# EasyEDA Pro project ProPrj_NRF9151 GILBERTO8_2026-06-28.epro, schematic Schematic1
Board Name: Board2; Create Date: 2026-05-17; Page Name: P1; Project Name: NRF9151 GILBERTO8; Schematic Name: Schematic1; Update Date: 2026-05-17; Company: EasyEDA.com; Page Size: A4; Version: V1.0
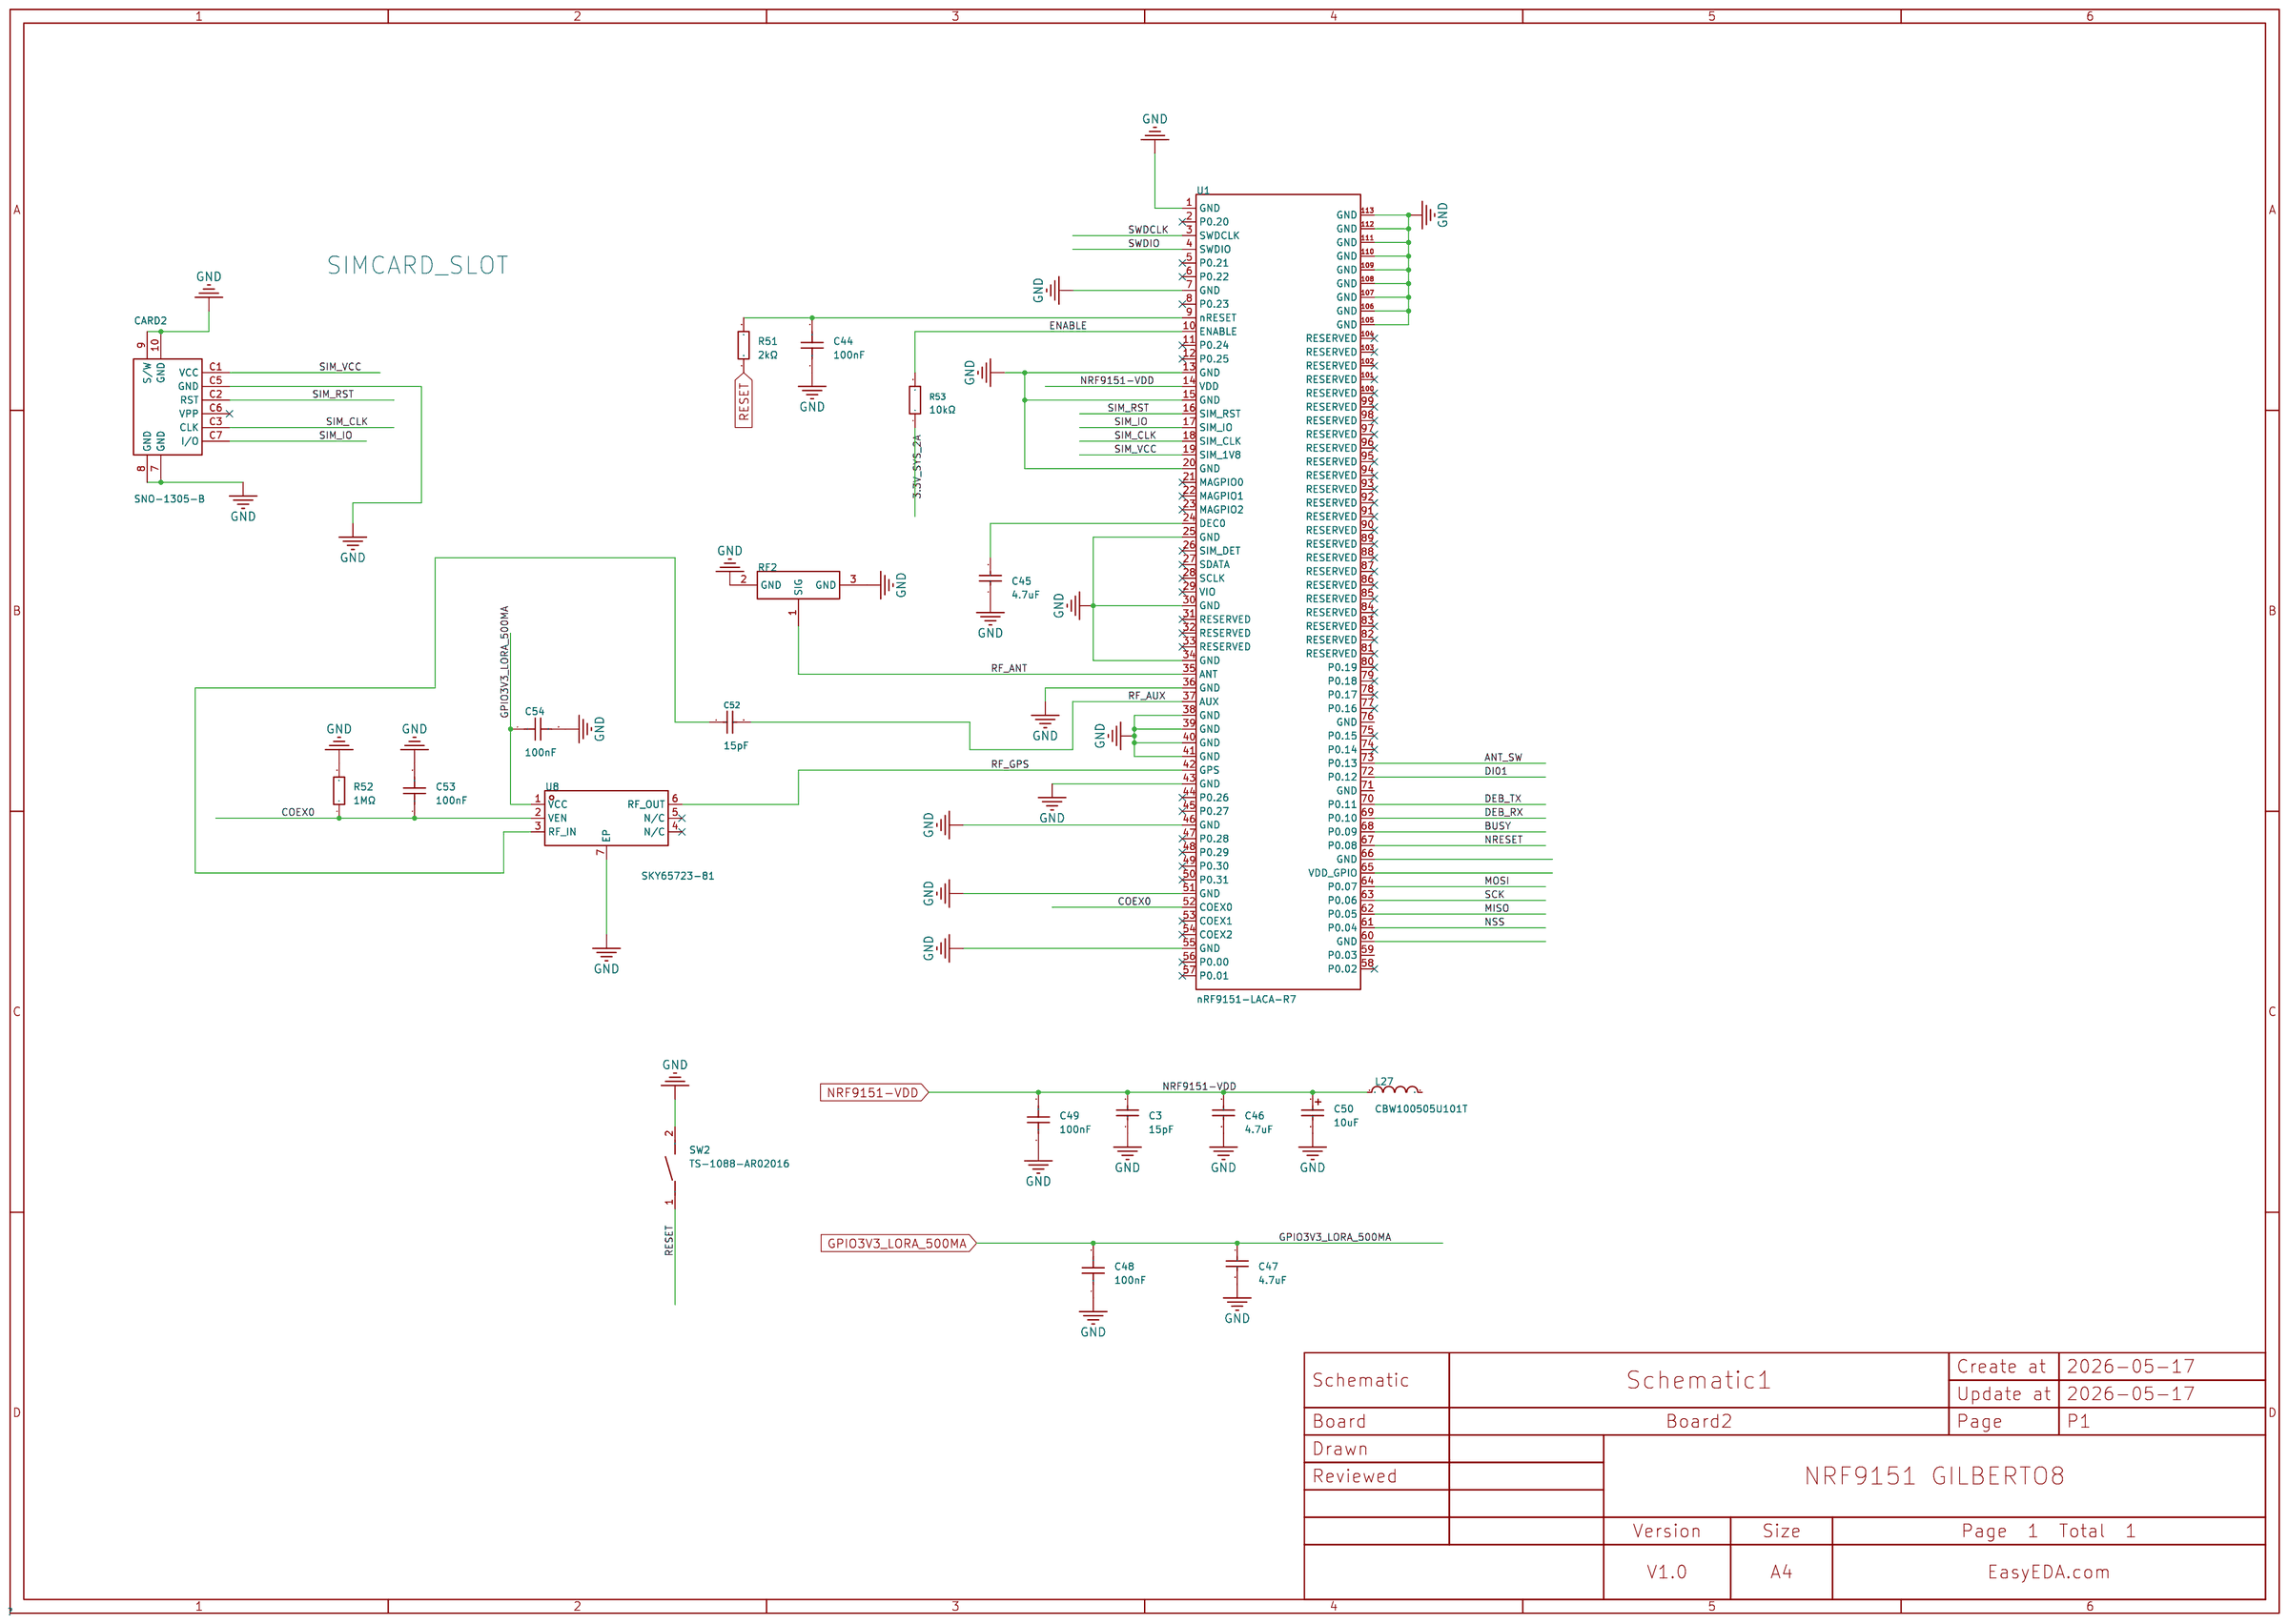
[diagram p1: schematic sheet]

## Parts
C3  15pF  [C0402]
C44  100nF  [C0402]
C45  4.7uF  [C0402]
C46  4.7uF  [C0402]
C47  4.7uF  [C0402]
C48  100nF  [C0402]
C49  100nF  [C0402]
C50  10uF  [CASE-A_3216]
C52  15pF  [C0201]
C53  100nF  [C0201]
C54  100nF  [C0201]
CARD2  SNO-1305-B  [SIM-SMD_SIM-1305-6P]
L27  CBW100505U101T  [L0402]
R51  2kΩ  [R0402]
R52  1MΩ  [R0402]
R53  10kΩ  [R0402]
RF2  6GHz  [RF-SMD_FRF05002-JSS103M]
SW2  TS-1088-AR02016  [SW-SMD_L3.9-W3.0-P4.45]
U1  nRF9151-LACA-R7  [LGA-113_L12.1-W11.1_NRF9151-LACA-R7]
U8  SKY65723-81  [MCM-6_L2.3-W1.7-P0.54-TL-EP]

## Library data of the parts
C3 = 0402CG150J500NT: Capacitance:15pF Tolerance:±5% Tolerance:±5% Voltage Rating:50V Temperature Coefficient:C0G; LCSC Part Name: 15pF ±5% 50V; Supplier Part: C1548; Manufacturer: FH(风华); Supplier Footprint: 0402; Datasheet: https://item.szlcsc.com/datasheet/0402CG150J500NT/1900.html; Supplier: LCSC; Tolerance: ±5%; Voltage Rating: 50V; Temperature Coefficient: C0G
C44 C48 C49 = CL05B104KO5NNNC: Capacitance:100nF Tolerance:±10% Tolerance:±10% Voltage Rating:16V Temperature Coefficient:X7R; LCSC Part Name: 100nF ±10% 16V; Supplier Part: C1525; Manufacturer: SAMSUNG(三星); Supplier Footprint: 0402; JLCPCB Part Class: Basic Part; Datasheet: https://item.szlcsc.com/datasheet/CL05B104KO5NNNC/1877.html; Supplier: LCSC; Tolerance: ±10%; Voltage Rating: 16V; Temperature Coefficient: X7R
C45-C47 = C1005X5R0J475MTJ00E: Capacitance:4.7uF Tolerance:±20% Tolerance:±20% Voltage Rating:6.3V Temperature Coefficient:X5R; LCSC Part Name: 4.7uF ±20% 6.3V; Supplier Part: C23687; Manufacturer: TDK; Supplier Footprint: 0402; Datasheet: https://item.szlcsc.com/datasheet/C1005X5R0J475MTJ00E/24423.html; Supplier: LCSC; Tolerance: ±20%; Voltage Rating: 6.3V; Temperature Coefficient: X5R
C50 = TAJA106K010RNJ: Capacitance:10uF Tolerance:±10% Tolerance:±10% Voltage Rating:10V Equivalent Series Resistance(ESR):3Ω@100kHz Operating Temperature:-55℃~+125℃ Operating Temperature:-55℃~+125℃; LCSC Part Name: 10uF ±10% 10V; Supplier Part: C7177; Manufacturer: Kyocera AVX; Supplier Footprint: CASE-A-3216-18(mm); Supplier: LCSC; Tolerance: ±10%; Voltage Rating: 10V; Equivalent Series Resistance(ESR): 3Ω@100kHz; Operating Temperature: -55℃~+125℃
C52 = 0201CG150J500NT: Capacitance:15pF Tolerance:±5% Tolerance:±5% Voltage Rating:50V Temperature Coefficient:C0G; LCSC Part Name: 15pF ±5% 50V; Supplier Part: C64554; Manufacturer: FH(风华); Supplier Footprint: 0201; Datasheet: https://item.szlcsc.com/datasheet/0201CG150J500NT/65621.html; Supplier: LCSC; Tolerance: ±5%; Voltage Rating: 50V; Temperature Coefficient: C0G
C53 C54 = CL03A104KP3NNNC: Capacitance:100nF Tolerance:±10% Tolerance:±10% Voltage Rating:10V Temperature Coefficient:X5R; LCSC Part Name: 100nF ±10% 10V; Supplier Part: C49062; Manufacturer: SAMSUNG(三星); Supplier Footprint: 0201; JLCPCB Part Class: Extended Part; Datasheet: https://item.szlcsc.com/datasheet/CL03A104KP3NNNC/50070.html; Supplier: LCSC; Tolerance: ±10%; Voltage Rating: 10V; Temperature Coefficient: X5R
CARD2 = SNO-1305-B: Card Connection Mode:Hinged Lid Card Type:Nano-SIM Card Connector Type:Connector and Ejector Card Detection:No Card Detect Height Above Board:1.4mm Operating Temperature:-35℃~+75℃ Operating Temperature:-35℃~+75℃; LCSC Part Name: 翻盖式 NanoSIM卡 卡座; Supplier Part: C111371; Manufacturer: SOFNG(硕方); Supplier Footprint: SMD; JLCPCB Part Class: Extended Part; Datasheet: https://item.szlcsc.com/datasheet/SNO-1305-B/112597.html; Supplier: LCSC; Card Connection Mode: Hinged Lid; Card Type: Nano-SIM Card; Connector Type: Connector and Ejector; Card Detection: No Card Detect; Height Above Board: 1.4mm; Operating Temperature: -35℃~+75℃
L27 = CBW100505U101T: Impedance @ Frequency:100Ω@100MHz Tolerance:±25% Tolerance:±25% DC Resistance(DCR):200mΩ Current Rating:450mA Number of Circuits:1; LCSC Part Name: 单路 0402磁珠 阻抗100Ω@100MHz; Supplier Part: C124089; Manufacturer: FH(风华); Supplier Footprint: 0402; Datasheet: https://item.szlcsc.com/datasheet/CBW100505U101T/125363.html; Supplier: LCSC; Impedance @ Frequency: 100Ω@100MHz; Tolerance: ±25%; DC Resistance(DCR): 200mΩ; Current Rating: 450mA; Number of Circuits: 1
R51 = RC0402FR-072KL: Type:Thick Film Resistor Resistance:2kΩ Tolerance:±1% Tolerance:±1% Power(Watts):62.5mW Voltage-Supply(Max):50V Temperature Coefficient:±100ppm/℃ Temperature Coefficient:±100ppm/℃ Operating Temperature:-55℃~+155℃ Operating Temperature:-55℃~+155℃; LCSC Part Name: 厚膜电阻 2kΩ ±1% 62.5mW; Supplier Part: C60488; Manufacturer: YAGEO(国巨); Supplier Footprint: 0402; JLCPCB Part Class: Extended Part; Datasheet: https://item.szlcsc.com/datasheet/RC0402FR-072KL/61540.html; Supplier: LCSC; Type: Thick Film Resistor; Tolerance: ±1%; Power(Watts): 62.5mW; Voltage-Supply(Max): 50V; Temperature Coefficient: ±100ppm/℃; Operating Temperature: -55℃~+155℃
R52 = CR0402FF1004G: Type:Thick Film Resistors Resistance: Tolerance:±1% Tolerance:±1% Power(Watts): Overload Voltage (Max): Temperature Coefficient:±200ppm/℃ Temperature Coefficient:±200ppm/℃ Operating Temperature Range:-55℃~+125℃ Operating Temperature Range:-55℃~+125℃; LCSC Part Name: 厚膜电阻 1MΩ ±1% 62.5mW; Supplier Part: C100198; Manufacturer: LIZ(丽智电子); Supplier Footprint: 0402; JLCPCB Part Class: Extended Part; Datasheet: https://atta.szlcsc.com/upload/public/pdf/source/20180403/C189438_6D658388CC7843F35BBC9018D03F0B8E.pdf; Supplier: LCSC; Type: Thick Film Resistors; Tolerance: ±1%; Temperature Coefficient: ±200ppm/℃; Operating Temperature Range: -55℃~+125℃
R53 = 0402WGJ0103TCE: Type:Thick Film Resistor Resistance:10kΩ Tolerance:±5% Tolerance:±5% Power(Watts):62.5mW Voltage-Supply(Max):50V Temperature Coefficient:±100ppm/℃ Temperature Coefficient:±100ppm/℃ Operating Temperature:-55℃~+155℃ Operating Temperature:-55℃~+155℃; LCSC Part Name: 10kΩ ±5% 62.5mW 厚膜电阻; Supplier Part: C25531; Manufacturer: UNI-ROYAL(厚声); Supplier Footprint: 0402; Datasheet: https://item.szlcsc.com/datasheet/0402WGJ0103TCE/26274.html; Supplier: LCSC; Type: Thick Film Resistor; Tolerance: ±5%; Power(Watts): 62.5mW; Voltage-Supply(Max): 50V; Temperature Coefficient: ±100ppm/℃; Operating Temperature: -55℃~+155℃
RF2 = U.FL-R-SMT-1(80)_C88374: Connector Type:Board Side Interface:Male Pin Number of Ports:1 Interface Diameter:2mm Interface Length/Height:1.25mm Frequency:6GHz RF Series:IPEX Impedance:50Ω Style:- Operating Temperature Range:-40℃~+90℃ Operating Temperature Range:-40℃~+90℃; LCSC Part Name: IPEX 内针; Supplier Part: C88374; Manufacturer: HRS(广濑); Manufacturer Part: U.FL-R-SMT-1(80); Supplier Footprint: SMD; JLCPCB Part Class: Extended Part; Datasheet: https://item.szlcsc.com/datasheet/U.FL-R-SMT-1(80)/89553.html; Supplier: LCSC; Connector Type: Board Side; Interface: Male Pin; Number of Ports: 1; Interface Diameter: 2mm; Interface Length/Height: 1.25mm; RF Series: IPEX; Impedance: 50Ω; Operating Temperature Range: -40℃~+90℃
SW2 = TS-1088-AR02016: Circuit:SPST Actuator Style:Round Button Operating Force:1.6N Mounting Type:Surface Mount,Vertical Length:4mm Width:3mm Switch Height:2mm with Bracket:Without Bracket Contact Current:50mA Voltage Rating:12V Actuator/Cap Color:Black Termination Style:SMD(S; LCSC Part Name: 4*3*2mm 立贴 轻触开关; Supplier Part: C720477; Manufacturer: XUNPU(讯普); Supplier Footprint: SMD,4x3mm; JLCPCB Part Class: Basic Part; Datasheet: https://item.szlcsc.com/datasheet/TS-1088-AR02016/763484.html; Supplier: LCSC; Circuit: SPST; Actuator Style: Round Button; Operating Force: 1.6N; Mounting Type: Surface Mount,Vertical; Length: 4mm; Width: 3mm; Switch Height: 2mm; with Bracket: Without Bracket; Contact Current: 50mA; Voltage Rating: 12V; Actuator/Cap Color: Black; Termination Style: SMD(SMT) Tab; Life: 100,000 Cycles; Operating Temperature: -30℃~+80℃
U1 = NRF9151-LACA-R_C42236596: LGA-113(12.1x11.1) RF Modules ROHS; LCSC Part Name: NRF9151-LACA-R; Supplier Part: C22397843; Manufacturer: Nordic Semicon; Supplier Footprint: LGA-113(12.1x11.1); JLCPCB Part Class: Extended Part; Datasheet: https://atta.szlcsc.com/upload/public/pdf/source/20250220/C59DB80833A870E26845E8E79822579D.pdf; Supplier: JLCPCB
U8 = SKY65723-81: Frequency Range:1.559GHz~1.606GHz Frequency Range:1.559GHz~1.606GHz Gain:16.8dB Noise Figure:1.6dB Voltage - Supply:1.62V~3.6V Voltage - Supply:1.62V~3.6V Current - Supply:4.2mA; Supplier Part: C2654196; Manufacturer: SKYWORKS; Supplier Footprint: MCM-6(1.7x2.3); Datasheet: https://item.szlcsc.com/datasheet/SKY65723-81/2746105.html; Supplier: LCSC; Frequency Range: 1.559GHz~1.606GHz; Gain: 16.8dB; Noise Figure: 1.6dB; Voltage - Supply: 1.62V~3.6V; Current - Supply: 4.2mA

## Nets
3.3V_SYS_2A: R53.1
GND: C3.1 C44.1 C45.1 C46.2 C47.2 C48.1 C49.1 C50.2 C53.2 C54.2 CARD2.7(GND) CARD2.8(GND) CARD2.9(S/W) CARD2.10(GND) CARD2.C5(GND) R52.2 RF2.2(GND) RF2.3(GND) SW2.2 U1.1(GND) U1.7(GND) U1.13(GND) U1.15(GND) U1.20(GND) U1.25(GND) U1.30(GND) U1.34(GND) U1.36(GND) U1.38(GND) U1.39(GND) U1.40(GND) U1.41(GND) U1.43(GND) U1.46(GND) U1.51(GND) U1.55(GND) U1.105(GND) U1.106(GND) U1.107(GND) U1.108(GND) U1.109(GND) U1.110(GND) U1.111(GND) U1.112(GND) U1.113(GND) U8.7(EP)
ANT_SW: U1.73(P0.13)
BUSY: U1.68(P0.09)
COEX0: C53.1 R52.1 U1.52(COEX0) U8.2(VEN)
DEB_RX: U1.69(P0.10)
DEB_TX: U1.70(P0.11)
DI01: U1.72(P0.12)
ENABLE: R53.2 U1.10(ENABLE)
GPIO3V3_LORA_500MA: C47.1 C48.2 C54.1 U8.1(VCC)
MISO: U1.62(P0.05)
MOSI: U1.64(P0.07)
NRESET: U1.67(P0.08)
NRF9151-VDD: C3.2 C46.1 C49.2 C50.1 L27.1 U1.14(VDD)
NSS: U1.61(P0.04)
RESET: R51.1 SW2.1
RF_ANT: RF2.1(SIG) U1.35(ANT)
RF_AUX: C52.2 U1.37(AUX)
RF_GPS: U1.42(GPS) U8.6(RF_OUT)
SCK: U1.63(P0.06)
SIM_CLK: CARD2.C3(CLK) U1.18(SIM_CLK)
SIM_IO: CARD2.C7(I/O) U1.17(SIM_IO)
SIM_RST: CARD2.C2(RST) U1.16(SIM_RST)
SIM_VCC: CARD2.C1(VCC) U1.19(SIM_1V8)
SWDCLK: U1.3(SWDCLK)
SWDIO: U1.4(SWDIO)
Net-(C44-2): C44.2 R51.2 U1.9(nRESET)
Net-(C45-2): C45.2 U1.24(DEC0)
Net-(C52-1): C52.1 U8.3(RF_IN)

Not connected (* = marked no-connect by the designer): CARD2 C6(VPP)*; L27 2; U1 2(P0.20)* 5(P0.21)* 6(P0.22)* 8(P0.23)* 11(P0.24)* 12(P0.25)* 21(MAGPIO0)* 22(MAGPIO1)* 23(MAGPIO2)* 26(SIM_DET)* 27(SDATA)* 28(SCLK)* 29(VIO)* 31(RESERVED)* 32(RESERVED)* 33(RESERVED)* 44(P0.26)* 45(P0.27)* 47(P0.28)* 48(P0.29)* 49(P0.30)* 50(P0.31)* 53(COEX1)* 54(COEX2)* 56(P0.00)* 57(P0.01)* 58(P0.02)* 59(P0.03) 60(GND) 65(VDD_GPIO) 66(GND) 71(GND) 74(P0.14)* 75(P0.15)* 76(GND) 77(P0.16)* 78(P0.17)* 79(P0.18)* 80(P0.19)* 81(RESERVED)* 82(RESERVED)* 83(RESERVED)* 84(RESERVED)* 85(RESERVED)* 86(RESERVED)* 87(RESERVED)* 88(RESERVED)* 89(RESERVED)* 90(RESERVED)* 91(RESERVED)* 92(RESERVED)* 93(RESERVED)* 94(RESERVED)* 95(RESERVED)* 96(RESERVED)* 97(RESERVED)* 98(RESERVED)* 99(RESERVED)* 100(RESERVED)* 101(RESERVED)* 102(RESERVED)* 103(RESERVED)* 104(RESERVED)*; U8 4(N/C)* 5(N/C)*

## Notes on the sheet
- SIMCARD_SLOT
